# Altium schematic sheet POWER.SchDoc: Power
size A4; DrawnBy: Louis Van Lommel; Engineer: Louis Van Lommel; Organization: TM De Nayer
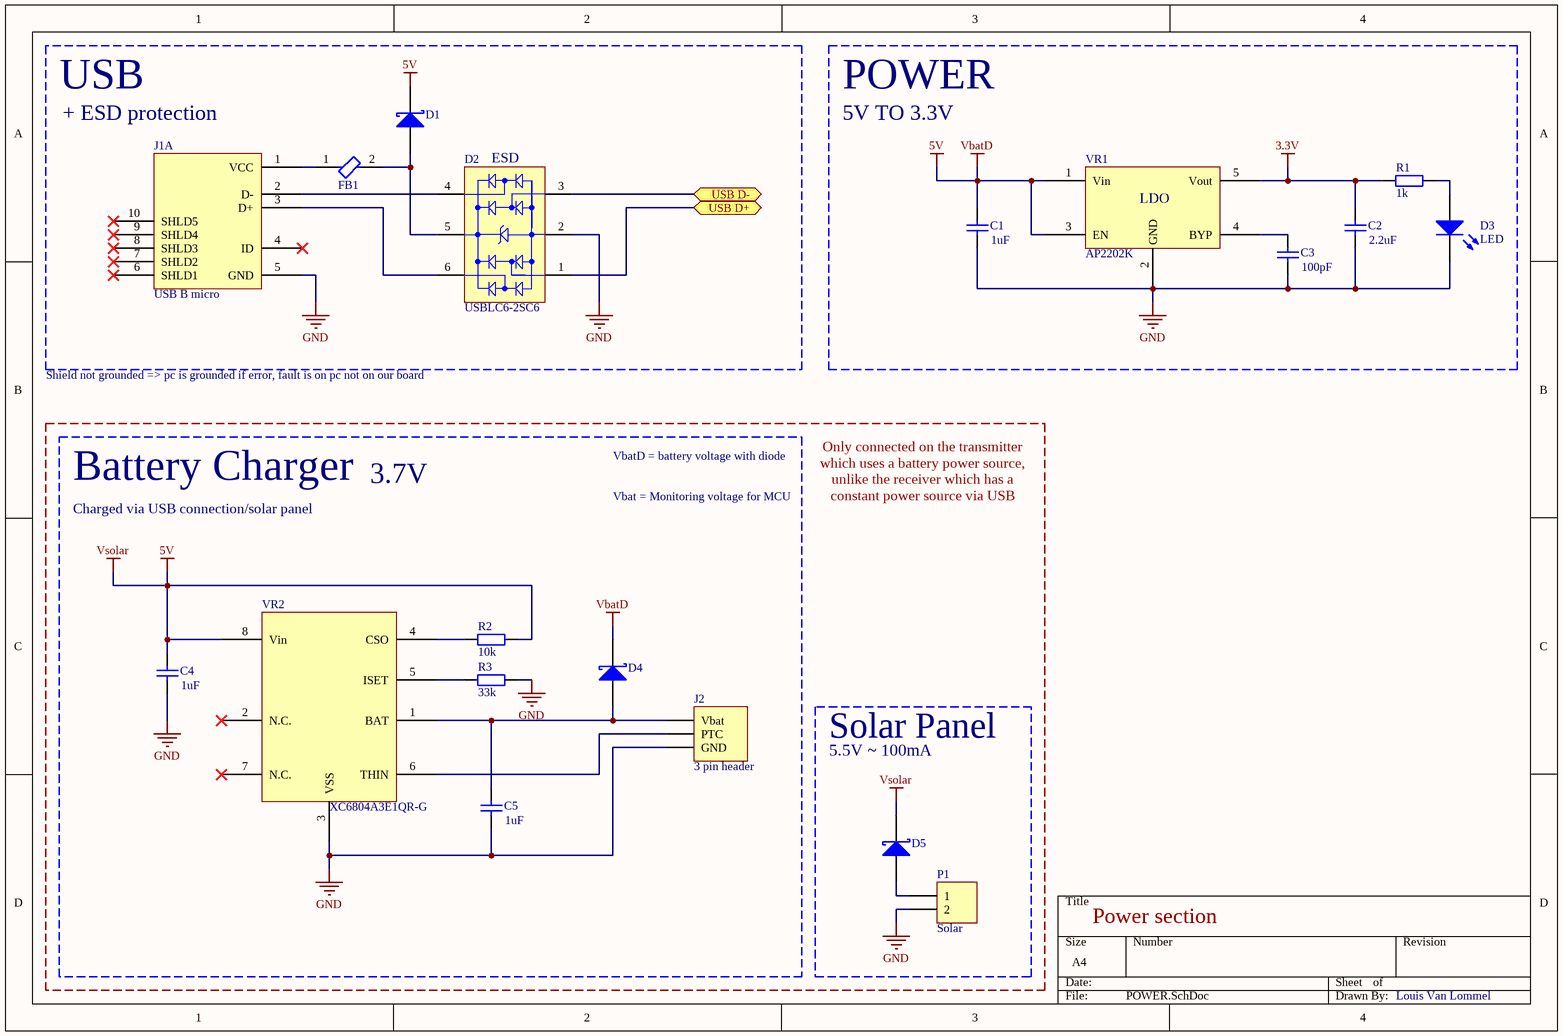
[diagram p0: POWER.SchDoc]

## Parts
C1  value 1uF  [CAP_0603]
C2  value 2.2uF  [CAP_0603]
C3  value 100pF  [CAP_0603]
C4  value 1uF  [CAP_0603]
C5  value 1uF  [CAP_0603]
D1  (no value)  [SOT-23_L]
D2  USBLC6-2SC6  [STM-SOT23-6L_V]
D3  LED  [LED_0603]
D4  (no value)  [SOT-23_L]
D5  (no value)  [SOT-23_L]
FB1  BLM18PG121SN1D  [FP-BLM18-0_15-t0_8-IPC_A]  (value not drawn)
J1  USB B micro  [USB Micro B]  (part A of 2)
J2  3 pin header  [Header_3]
P1  Solar  [HDR1X2]
R1  value 1k  [RES_0603]
R2  value 10k  [RES_0603]
R3  value 33k  [RES_0603]
VR1  AP2202K  [SOT23-5]
VR2  XC6804A3E1QR-G  [SOP127P600-8N]

## Blocks framed on the sheet
USB: D1 D2 FB1 J1
POWER: C1-C3 D3 R1 VR1
Battery Charger: C4 C5 D4 J2 R2 R3 VR2
Solar Panel: D5 P1

## Ports
USB D+ (bidir), USB D- (bidir)

## Nets
3.3V: C2.2 R1.2 VR1.5(Vout)
5V: C1.2 C4.2 D1.3(K) D4.3(K) D5.3(K) R2.1 VR1.1(Vin) VR1.3(EN) VR2.8(Vin)  [also labelled VbatD, Vsolar]
GND: C1.1 C2.1 C3.1 C4.1 C5.1 D2.2(GND) D3.2(K) J1.5(GND) J2.3(GND) P1.2 R3.1 VR1.2(GND) VR2.3(VSS)
USB D+: D2.1(I/O_1) ; port USB D+
USB D-: D2.3(I/O_2) ; port USB D-
NetC3_2: C3.2 VR1.4(BYP)
NetC5_2: C5.2 D4.1(A) J2.1(Vbat) VR2.1(BAT)
NetD1_1: D1.1(A) D2.5(VBUS) FB1.2
NetD2_4: D2.4(I/O_3) J1.2(D-)
NetD2_6: D2.6(I/O_4) J1.3(D+)
NetD3_1: D3.1(A) R1.1
NetD5_1: D5.1(A) P1.1
NetFB1_1: FB1.1 J1.1(VCC)
NetJ2_2: J2.2(PTC) VR2.6(THIN)
NetR2_2: R2.2 VR2.4(CSO)
NetR3_2: R3.2 VR2.5(ISET)

Not connected (* = marked no-connect by the designer): J1 4(ID)* 6(SHLD1)* 7(SHLD2)* 8(SHLD3)* 9(SHLD4)* 10(SHLD5)*; VR2 2(N.C.)* 7(N.C.)*

## Notes on the sheet
- (near J1) + ESD protection
- (near D2) ESD
- 5V TO 3.3V
- (near VR1) LDO
- Shield not grounded => pc is grounded if error, fault is on pc not on our board
- Charged via USB connection/solar panel
- 3.7V
- Vbat = Monitoring voltage for MCU
- VbatD = battery voltage with diode
- Only connected on the transmitter which uses a battery power source, unlike the receiver which has a constant power source via USB
- 5.5V ~ 100mA
- Power section
- Louis Van Lommel
- Title
- Size:
- Date:
- A4
- Number:
- Time:
- Revision:
- Sheet
- of
- File:

## Library data of the parts
C1-C5 = Cap: Capacitor; Published: 8-Jun-2000; LatestRevisionDate: 17-Jul-2002; LatestRevisionNote: Re-released for DXP Platform.; PackageReference: RAD-0.3; Publisher: Altium Limited; PackageDescription: Radial Cap, Thru-Hole; 2 Leads; 0.3 in Pin Spacing
D1 D4 D5 = Diode BAT17: Silicon RF Schottky Diode for Mixer Applications in the VHF/UHF Range; Note: Pin 2 is not connected and not drawn.; Published: 21-Mar-2003; LatestRevisionDate: 29-May-2009; LatestRevisionNote: IPC-7351 Footprint Added.; DatasheetVersion: Oct-1999; PackageVersion: Sep-2001; PackageReference: SOT-23; Publisher: Altium Limited; PackageDescription: 3-Pin SOT-23 Package 0.95 mm Pitch, 2.5 mm Lead Span; ComponentLink1Description: Manufacturer Link; ComponentLink1URL: http://www.infineon.com/; ComponentLink2Description: Datasheet; ComponentLink2URL: http://www.infineon.com/upload/Document/cmc_upload/documents/009/363/bat17series.pdf
D2 = CMP-2000-05378-1: Very low capacitance ESD protection, 3.5 pF, -40 to 125 degC, 6-Pin SOT23, RoHS, Tape and Reel; Manufacturer: STMicroelectronics; Polarity: Uni-Directional; Clamping Voltage: 17V; Rad Hardened: No; Product Height (mm): 1.3mm; Leakage Current (Max): 0.15uA; Product Length (mm): 3.05mm; Number of Elements: 1; Peak Pulse Current: 5A; Configuration: Dual; Reverse Breakdown Voltage: 6V; Working Voltage (Max): 5V; Capacitance Value: 3.5pF; Suppressor Type: DiodeArrays; Product Depth (mm): 1.75mm; Test Current (It): 1mA; Package / Case: SOT-23; Operating Temperature Max Deg. C: 125C; Package Description: 6-Pin Small Outline Transistor, Body 2.925 x 1.625 mm, Pitch 0.95 mm; Package Reference: SOT23-6L; Datasheet Version: Rev. 5, 10/2011; Operating Temperature Min Deg. C: -40C; Mounting Style: SurfaceMount; Direction Type: Uni-Directional; Mounting: SurfaceMount; Pin Count: 6; Leakage Current: 0.15uA; Packaging: TapeandReel; Operating Temperature Classification: Automotive; Clamping Voltage (Max): 17V; Manufacturer URL: http://www.st.com/; Reverse Stand-off Voltage: 5V; Datasheet URL: http://www.st.com/st-web-ui/static/active/en/resource/technical/document/datasheet/CD00050750.pdf; Working Voltage: 5V; Operating Temp Range: -40Cto125C
D3 = LED2: Typical RED, GREEN, YELLOW, AMBER GaAs LED; Published: 8-Jun-2000; LatestRevisionDate: 17-Jul-2002; LatestRevisionNote: Re-released for DXP Platform.; PackageVersion: Feb-2002; PackageReference: 3.2X1.6X1.1; Publisher: Altium Limited; PackageDescription: SM LED; 2 Flat Leads
FB1 = CMP-0686-00557-7: Chip Ferrite Bead, 0603, 120Ω @ 100MHz, 0.05Ω, 25%, 2A; Impedance: 120R; Number of Circuits: 1; Shielding: Unshielded; Material: Steel; DC Resistance (DCR): 50mR; Case Code (Imperial): 0603; RoHS Compliant: Yes; Number of Pins: 2; Min Operating Temperature: -55°C; Case Code (Metric): 1608; Frequency: 100MHz; Length: 1.6mm; Test Frequency: 100MHz; Max Operating Temperature: 125°C; Packaging: Tape and Reel; Max Current Rating: 2A; Termination: SMD/SMT; Lead Free: Lead Free; Max DC Current: 2A; Case/Package: 0603; Height: 0.8mm; Current Rating: 2A; Radiation Hardening: No; Core Material: Ferrite; DC Current: 2A; REACH SVHC: No SVHC; Package Quantity: 1; Depth: 0.8mm; Number of Lines: 1; Tolerance: 25%; Width: 0.8mm
J1 = USB micro B
J2 = Header_3
P1 = Header 2H: Header, 2-Pin, Right Angle; LatestRevisionDate: 17-Jul-2002; LatestRevisionNote: Re-released for DXP Platform.; Publisher: Altium Limited
R1 R2 = Res2: Resistor; Published: 8-Jun-2000; LatestRevisionDate: 17-Jul-2002; LatestRevisionNote: Re-released for DXP Platform.; PackageReference: AXIAL-0.4; Publisher: Altium Limited; PackageDescription: Axial Device, Thru-Hole; 2 Leads; 0.4 in Pin Spacing
R3 = Res2: Determines charging speed => p14. Datasheet                                 40kohm => 200mA max, solar only has 100mA; Published: 8-Jun-2000; LatestRevisionDate: 17-Jul-2002; LatestRevisionNote: Re-released for DXP Platform.; PackageReference: AXIAL-0.4; Publisher: Altium Limited; PackageDescription: Axial Device, Thru-Hole; 2 Leads; 0.4 in Pin Spacing
VR1 = AP2202K-3.3TRG1: AP2112K-3.3TRG1 | 3.3V LDO | 2.5V — 13.2V